# Altium schematic sheet PWR SMPS 6A 28V.SchDoc
size 209 x 297 mm; Author: Мурашкин Д.В.; Address1: Address1; Address2: Address2; Address3: Address3; Address4: Address4; DocumentNumber: SS19946-01; Scale: 1:1; Letter1Column: Э; PartName: Блок питания
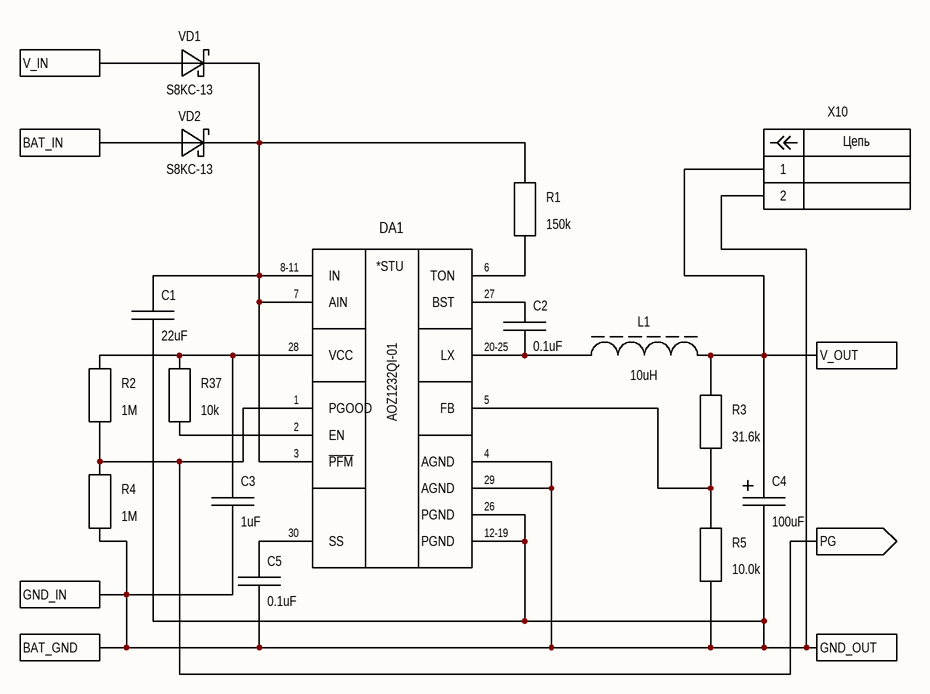
[diagram p0: PWR SMPS 6A 28V.SchDoc]

## Parts
C1  22uF  [CAPC2012L]
C2  0.1uF  [CAPC1608L]
C3  1uF  [CAPC1608L]
C4  100uF  [CAPA6.3LS]
C5  0.1uF  [CAPC1608L]
DA1  AOZ1232QI-01  [QFN-30 (5x5)]
L1  10uH  [INDF12.5x12.5SSH]
R1  150k  [RESC1608L]
R2  1M  [RESC1608L]
R3  31.6k  [RESC1608L]
R4  1M  [RESC1608L]
R5  10.0k  [RESC1608L]
R37  10k  [RESC1608L]
VD1  S8KC-13  [DO-214AB]
VD2  S8KC-13  [DO-214AB]
X10  B2B-XH-A N.M.  [B2B-XH-A N.M.]  (value not drawn)  (no BOM)

## Ports
BAT_GND, BAT_IN, GND_IN, GND_OUT, PG (out), V_IN, V_OUT

## Nets
BAT_GND: C1.2 C3.2 C4.2 C5.2 DA1.4(AGND) DA1.12-19(PGND) DA1.26(PGND) DA1.29(AGND) R4.2 R5.2 X10.2 ; port GND_IN, port BAT_GND, port GND_OUT
BAT_IN: VD2.1(Anode) ; port BAT_IN
PG: DA1.1(PGOOD) R2.2 R4.1 ; port PG
V_IN: VD1.1(Anode) ; port V_IN
V_OUT: C4.1 L1.2 R3.1 X10.1 ; port V_OUT
NetC1_1: C1.1 DA1.3(~{PFM}) DA1.7(AIN) DA1.8-11(IN) R1.1 VD1.2(Cathode) VD2.2(Cathode)
NetC2_1: C2.1 DA1.27(BST)
NetC2_2: C2.2 DA1.20-25(LX) L1.1
NetC3_1: C3.1 DA1.28(VCC) R2.1 R37.1
NetC5_1: C5.1 DA1.30(SS)
NetDA1_2: DA1.2(EN) R37.2
NetDA1_5: DA1.5(FB) R3.2 R5.1
NetDA1_6: DA1.6(TON) R1.2

## Notes on the sheet
- Перв. примен.
- Справ. №
- Подп. и дата
- Инв. № дубл.
- Взам. инв. №
- Разраб.
- Изм.
- Лист
- № докум.
- Подп.
- Дата
- Лит.
- Масса
- Масштаб
- Пров.
- Т.контр.
- Листов
- Инв. № подл.
- Утв.
- Н.контр.
- 2.106-A4
- Копировал
- Формат А4
- (in symbol AOZ1232QI-01) *STU
- (in symbol B2B-XH-A N.M.) Цепь

## Library data of the parts
C1 = CC0805MKX5R8BB226: Capacitor Ceramic 22uF 25V; Manufacturer: Yageo; Group: Ceramic Capacitors; Temperature Coefficient: X5R; Tolerance: ±20%; Short description: CAP CER 122UF 25V X5R 0805; Type: Ceramic; Part name: CC0805MKX5R8BB226; Voltage: 25V; Package: 2012; Value: 22uF
C2 C5 = CC0603KRX7R8BB104: Capacitor Ceramic 0.1uF 25V; Manufacturer: Yageo; Group: Ceramic Capacitors; Temperature Coefficient: X7R; Tolerance: ±10%; Short description: CAP CER 0.1UF 25V X7R 0603; Type: Ceramic; Part name: CC0603KRX7R8BB104; Voltage: 25 V; Package: 1608; Value: 0.1uF
C3 = CC0603KRX5R8BB105: Capacitor Ceramic 1uF 25V; Manufacturer: Yageo; Group: Ceramic Capacitors; Temperature Coefficient: X5R; Tolerance: ±10%; Short description: CAP CER 1UF 25V X5R 0603; Type: Ceramic; Part name: CC0603KRX5R8BB105; Voltage: 25V; Package: 1608; Value: 1uF
C4 = UWT1E101MCL1GS: Capacitor Aluminum 100uF 25V; Manufacturer: Nichicon; Group: Aluminum Capacitors; Tolerance: ±20%; Type: Aluminium; Short description: CAP ALU 100UF 25V 6.6x6.6x7.7; Part name: UWT1E101MCL1GS; Voltage: 25V; Package: 6.6x6.6x7.7mm; Value: 100uF
DA1 = AOZ1232QI-01: SWR Down, 6A, 0.1-1MHz, 2.7-28V, 0.8-23.8V; Manufacturer: Alpha & Omega Semiconductor; Group: PMIC - Voltage Regulators - DC DC Switching Regulators; Short description: IC REG BST ADJ 5A SYNC 30-QFN; Package: 30-QFN (5x5); Part name: AOZ1232QI-01
L1 = SRR1260-100M: Fixed Inductor 10µH 5.5A; Manufacturer: Bourns; Group: Fixed Inductors; Tolerance: ±30%; Type: Wirewound; Current Rating: 2.35A; Short description: FIXED IND 10UH 5.5A 20 MOHM; Part name: SRR1260-100M; Package: 12.5x12.5x6.5mm; Value: 10uH
R1 = RC0603JR-07150KL: Resistor Ceramic 150k 1608; Manufacturer: Yageo; Group: Resistors; Temperature Coefficient: ±100ppm/°C; Tolerance: ±5%; Power: 0.1W; Short description: RES SMD 150K OHM 5% 1/10W 0603; Part name: RC0603JR-07150KL; Type: Thin Film; Package: 1608; Value: 150k
R2 R4 = RC0603JR-071ML: Resistor Ceramic 1M 1608; Manufacturer: Yageo; Group: Resistors; Temperature Coefficient: ±100ppm/°C; Tolerance: ±5%; Power: 0.1W; Short description: RES SMD 1M OHM 5% 1/10W 0603; Part name: RC0603JR-071ML; Type: Thin Film; Package: 1608; Value: 1M
R3 = RC0603FR-0731K6L: Resistor Ceramic 31.6k 1608 ±1%; Manufacturer: Yageo; Group: Resistors; Temperature Coefficient: ±100ppm/°C; Power: 0.1W; Short description: RES SMD 31.6K OHM 1% 1/10W 0603; Part name: RC0603FR-0731K6L; Tolerance: ±1%; Type: Thin Film; Package: 1608; Value: 31.6k
R5 = RC0603FR-0710KL: Resistor Ceramic 10k 1608 ±1%; Manufacturer: Yageo; Group: Resistors; Temperature Coefficient: ±100ppm/°C; Power: 0.1W; Short description: RES SMD 10K OHM 1% 1/10W 0603; Part name: RC0603FR-0710KL; Tolerance: ±1%; Type: Thin Film; Package: 1608; Value: 10.0k
R37 = RC0603JR-0710KL: Resistor Ceramic 10k 1608; Manufacturer: Yageo; Group: Resistors; Temperature Coefficient: ±100ppm/°C; Tolerance: ±5%; Voltage: 75 V; Power: 0.1W; Short description: RES SMD 10K OHM 5% 1/10W 0603; Part name: RC0603JR-0710KL; Type: Thin Film; Package: 1608; Value: 10k
VD1 VD2 = S8KC-13: Diode Schottky, 8A, 800V; Manufacturer: ON Semiconductor; Group: Diodes - Rectifiers - Single; Short description: DIODE GEN PURP 800V 8A SMC; Package: DO-214AB; Distributor: Digi-Key; Part name: S8KC-13
X10 = B2B-XH-A N.M.: Header, 2.54, 2p, Top; Manufacturer: JST Sales America Inc; Part name: B2B-XH-A(LF)(SN); Group: Rectangular Connectors - Headers, Male Pins; Short description: CONN HEADER XH TOP 2POS 2.5MM; Package: 2 DIP 2.54; Distributor: Digi-Key